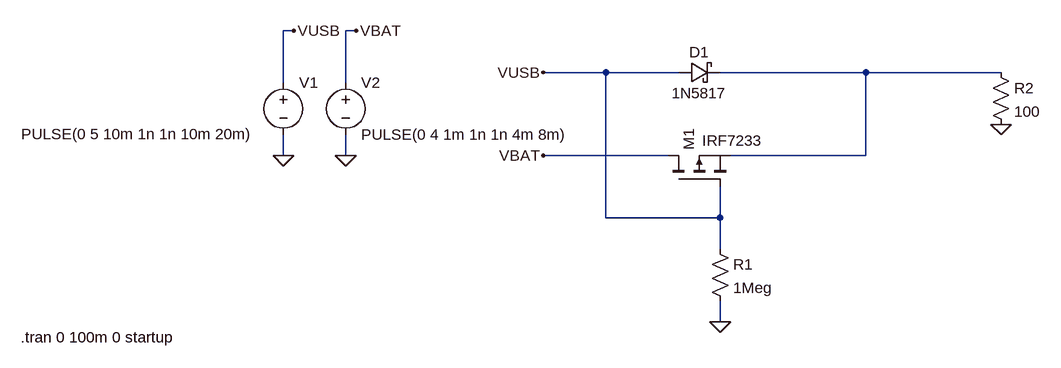
[diagram p0: schematic buck.asc]
buck.asc, the LTspice schematic file:
Version 4
SHEET 1 880 680
WIRE -384 16 -400 16
WIRE -288 16 -304 16
WIRE 96 80 0 80
WIRE 208 80 96 80
WIRE 496 80 272 80
WIRE 704 80 496 80
WIRE -400 96 -400 16
WIRE -304 96 -304 16
WIRE -400 208 -400 176
WIRE -304 208 -304 176
WIRE 192 208 0 208
WIRE 496 208 496 80
WIRE 496 208 288 208
WIRE 96 304 96 80
WIRE 272 304 272 256
WIRE 272 304 96 304
WIRE 272 352 272 304
WIRE 272 464 272 432
FLAG -400 208 0
FLAG -304 208 0
FLAG -384 16 VUSB
FLAG -288 16 VBAT
FLAG 0 208 VBAT
FLAG 0 80 VUSB
FLAG 272 464 0
FLAG 704 160 0
SYMBOL pmos 192 256 R270
WINDOW 3 71 52 VRight 2
SYMATTR InstName M1
SYMATTR Value IRF7233
SYMBOL schottky 208 96 R270
WINDOW 0 32 32 VTop 2
WINDOW 3 0 32 VBottom 2
SYMATTR InstName D1
SYMATTR Value 1N5817
SYMATTR Description Diode
SYMATTR Type diode
SYMBOL voltage -400 80 R0
WINDOW 3 -403 95 Left 2
WINDOW 123 0 0 Left 0
WINDOW 39 0 0 Left 0
SYMATTR InstName V1
SYMATTR Value PULSE(0 5 10m 1n 1n 10m 20m)
SYMBOL voltage -304 80 R0
WINDOW 123 0 0 Left 0
WINDOW 39 0 0 Left 0
SYMATTR InstName V2
SYMATTR Value PULSE(0 4 1m 1n 1n 4m 8m)
SYMBOL res 256 336 R0
SYMATTR InstName R1
SYMATTR Value 1Meg
SYMBOL res 688 64 R0
SYMATTR InstName R2
SYMATTR Value 100
TEXT -804 488 Left 2 !.tran 0 100m 0 startup

The netlist it stands for:
* buck.asc
M1 VBAT VUSB N001 N001 IRF7233
D1 VUSB N001 1N5817
V1 VUSB 0 PULSE(0 5 10m 1n 1n 10m 20m)
V2 VBAT 0 PULSE(0 4 1m 1n 1n 4m 8m)
R1 VUSB 0 1Meg
R2 N001 0 100
.model D D
.lib standard.dio
.model NMOS NMOS
.model PMOS PMOS
.lib standard.mos
.tran 0 100m 0 startup
.backanno
.end